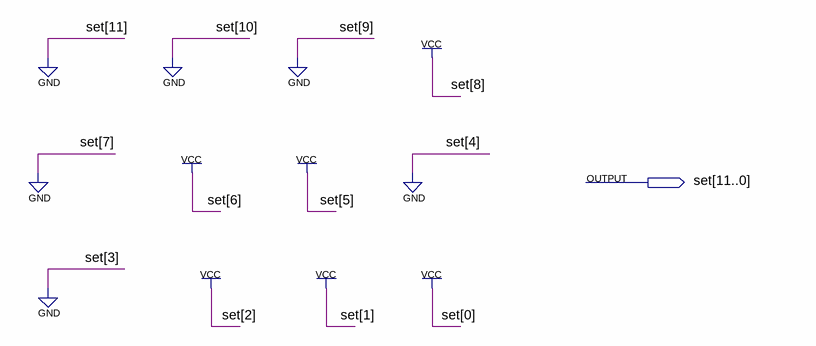
[diagram p0: schematic sheet]
// Quartus schematic cin.bdf as structural Verilog: 0 symbols, 1 pins
module cin (
  output [11:0] set
);


  assign set = 12'b000101100111;
endmodule
